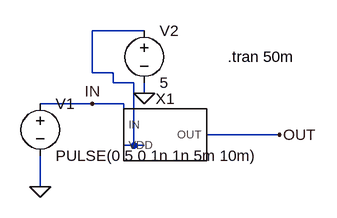
[diagram p0: schematic test_NOT.asc]
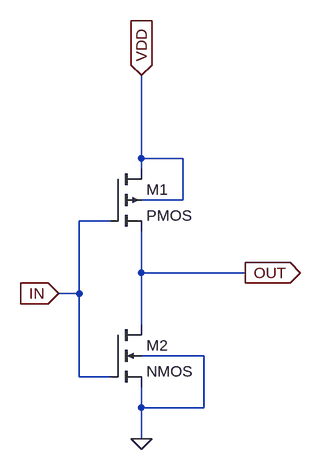
[diagram p1: sub-circuit not1.asc]
test_NOT.asc, the LTspice schematic file:
Version 4.1
SHEET 1 880 680
WIRE 336 80 256 80
WIRE 256 144 256 80
WIRE 288 144 256 144
WIRE 288 160 288 144
WIRE 320 160 288 160
WIRE 336 176 336 160
WIRE 256 192 176 192
WIRE 304 192 256 192
WIRE 304 224 304 192
WIRE 544 240 432 240
WIRE 320 256 320 160
WIRE 320 256 304 256
WIRE 336 256 320 256
WIRE 176 320 176 272
FLAG 176 320 0
FLAG 544 240 OUT
FLAG 256 192 IN
FLAG 336 176 0
SYMBOL NOT1 368 240 R0
SYMATTR InstName X1
SYMBOL voltage 176 176 R0
WINDOW 123 0 0 Left 0
WINDOW 39 0 0 Left 0
SYMATTR InstName V1
SYMATTR Value PULSE(0 5 0 1n 1n 5m 10m)
SYMBOL voltage 336 64 R0
WINDOW 123 0 0 Left 0
WINDOW 39 0 0 Left 0
SYMATTR InstName V2
SYMATTR Value 5
TEXT 464 120 Left 2 !.tran 50m

not1.asc, the sub-circuit schematic file:
Version 4.1
SHEET 1 880 680
WIRE 240 176 240 48
WIRE 304 176 240 176
WIRE 240 192 240 176
WIRE 304 240 304 176
WIRE 304 240 240 240
WIRE 192 272 144 272
WIRE 240 352 240 288
WIRE 400 352 240 352
WIRE 144 384 144 272
WIRE 144 384 112 384
WIRE 240 432 240 352
WIRE 336 480 240 480
WIRE 144 512 144 384
WIRE 192 512 144 512
WIRE 240 560 240 528
WIRE 336 560 336 480
WIRE 336 560 240 560
WIRE 240 608 240 560
FLAG 240 608 0
FLAG 112 384 IN
IOPIN 112 384 In
FLAG 400 352 OUT
IOPIN 400 352 Out
FLAG 240 48 VDD
IOPIN 240 48 In
SYMBOL pmos4 192 192 R0
SYMATTR InstName M1
SYMBOL nmos4 192 432 R0
SYMATTR InstName M2

The netlist it stands for:
* test_NOT.asc
X§X1 IN N001 OUT not1
V1 IN 0 PULSE(0 5 0 1n 1n 5m 10m)
V2 N001 0 5

* block symbol definitions
.subckt not1 IN VDD OUT
M1 VDD IN OUT VDD PMOS
M2 OUT IN 0 0 NMOS
.ends not1

.model NMOS NMOS
.model PMOS PMOS
.lib standard.mos
.tran 50m
.backanno
.end